# Altium schematic sheet Sensors.SchDoc
size A2; SheetNumber: 2; SheetTotal: 3
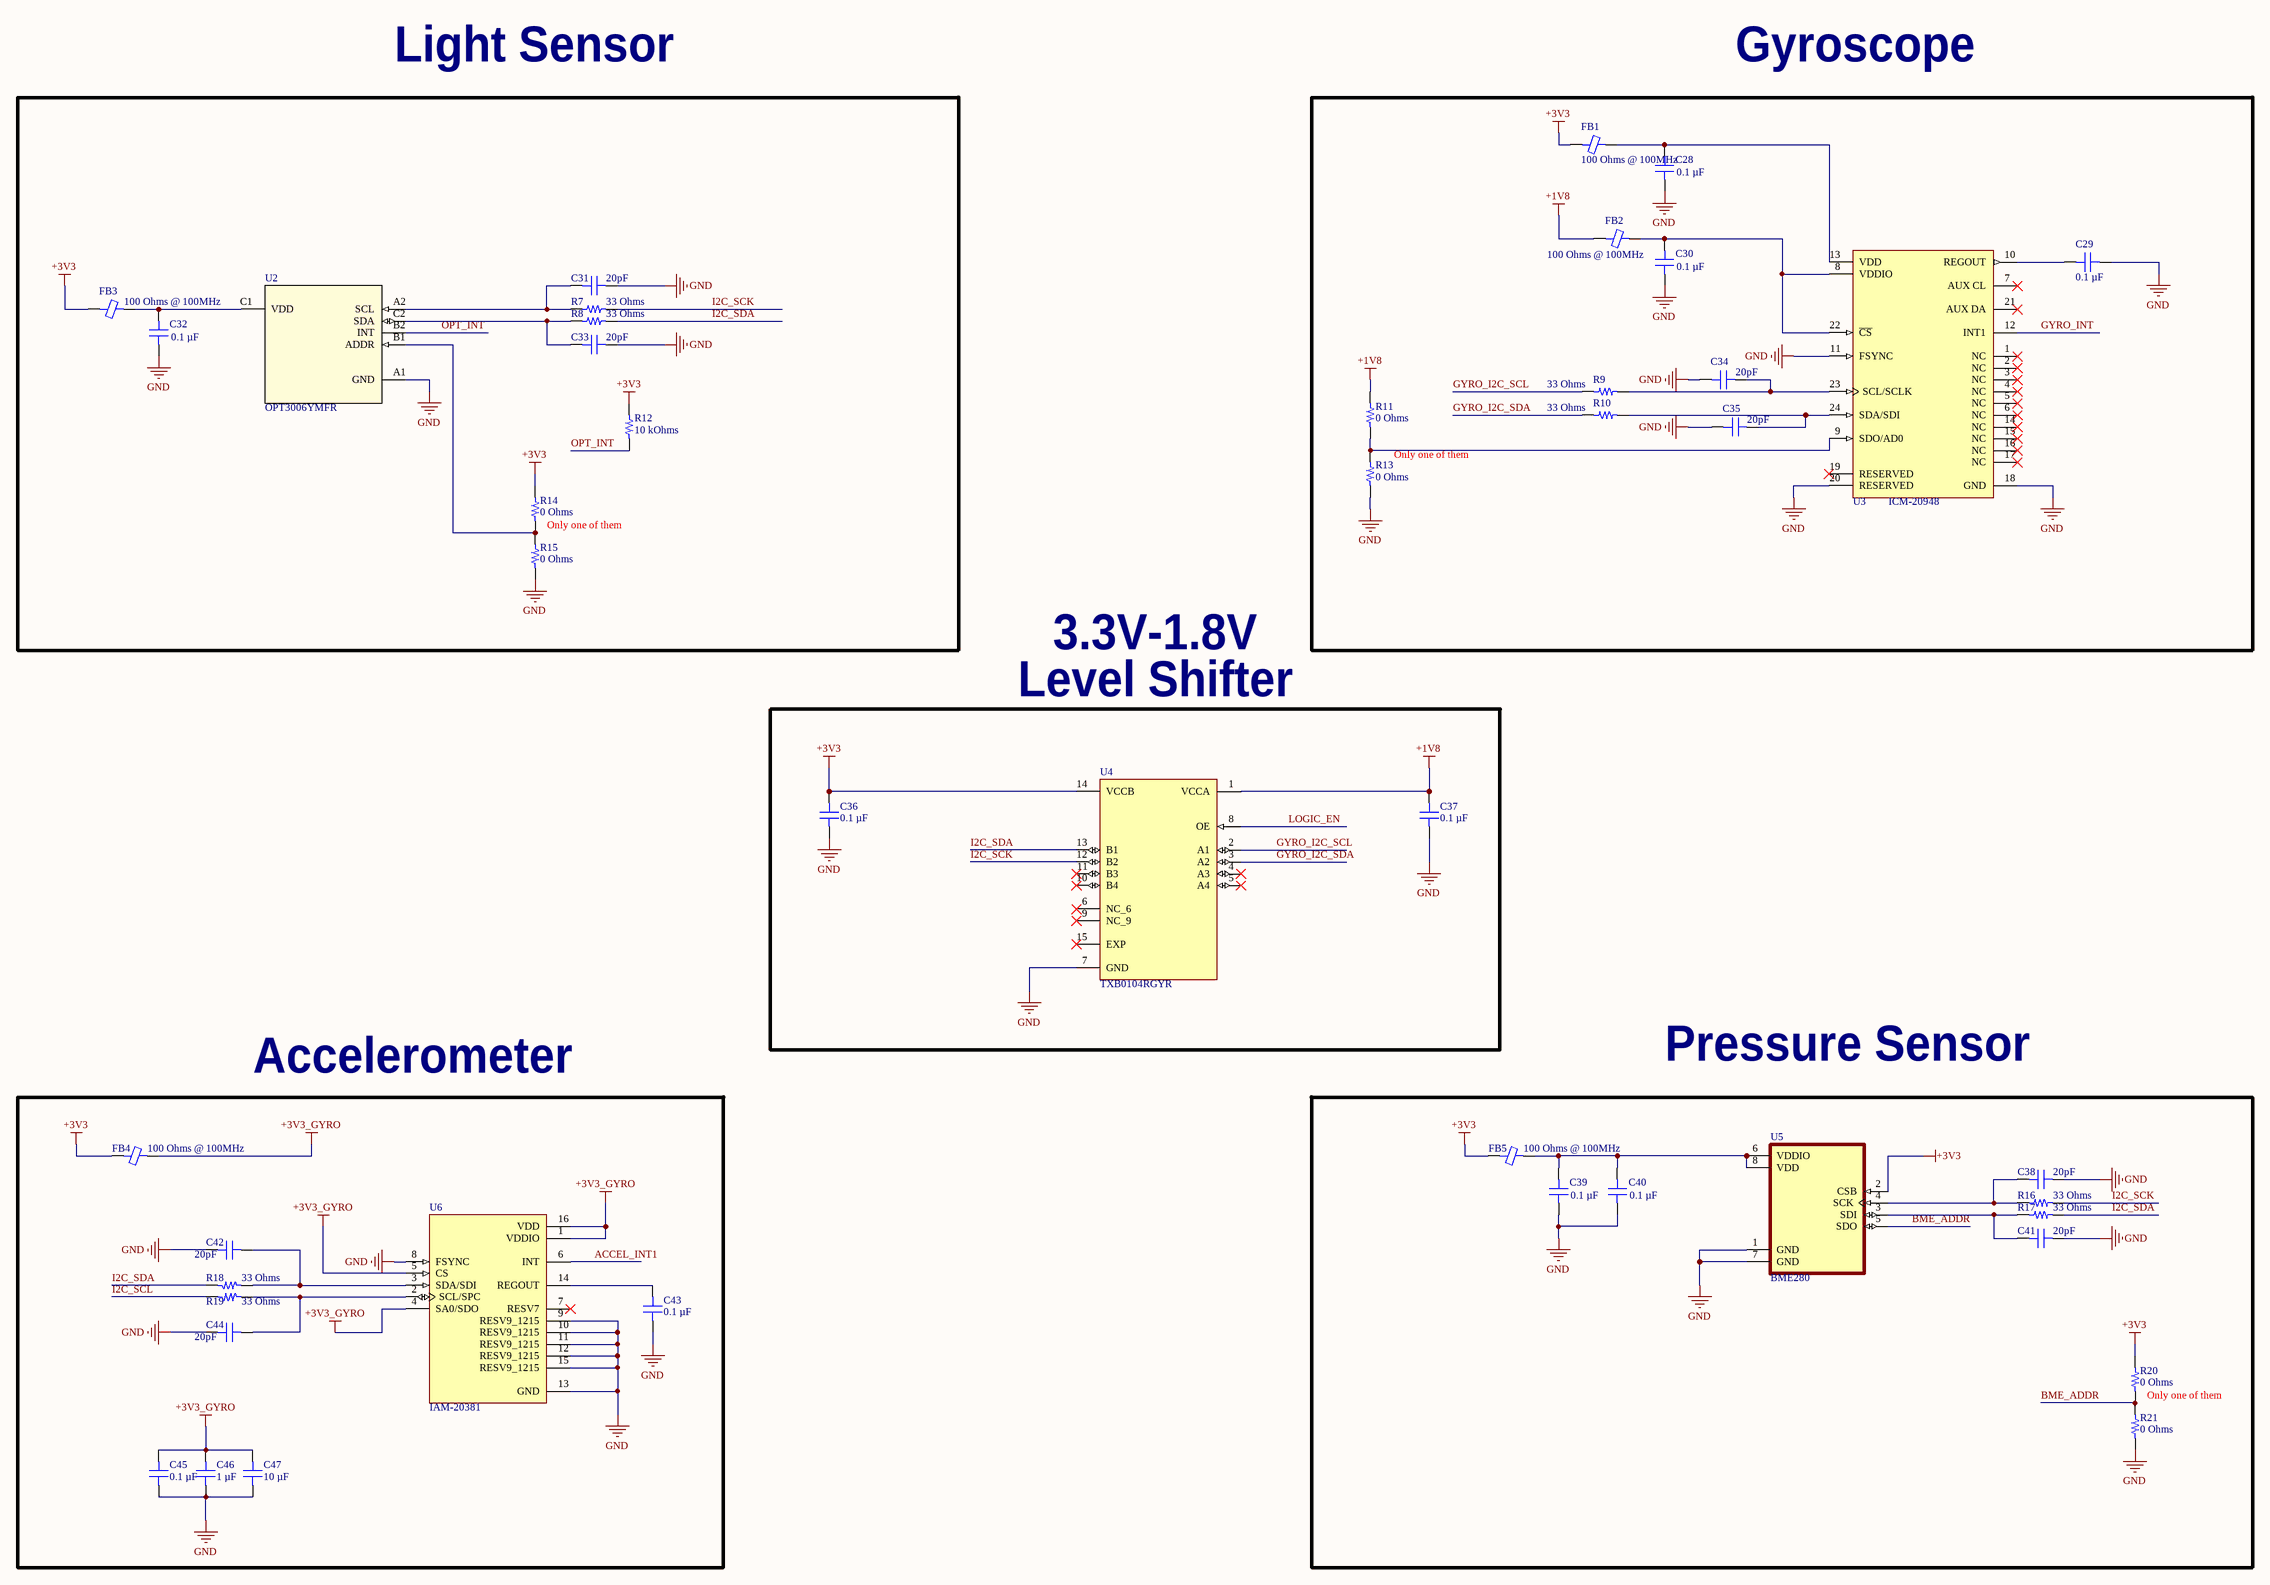
[diagram p0: Sensors.SchDoc]

## Parts
C28  0.1 µF  [CAP 0603_1608]
C29  0.1 µF  [CAP 0603_1608]
C30  0.1 µF  [CAP 0603_1608]
C31  20pF  [CAP 0603_1608]
C32  0.1 µF  [CAP 0603_1608]
C33  20pF  [CAP 0603_1608]
C34  20pF  [CAP 0603_1608]
C35  20pF  [CAP 0603_1608]
C36  0.1 µF  [CAP 0603_1608]
C37  0.1 µF  [CAP 0603_1608]
C38  20pF  [CAP 0603_1608]
C39  0.1 µF  [CAP 0603_1608]
C40  0.1 µF  [CAP 0603_1608]
C41  20pF  [CAP 0603_1608]
C42  20pF  [CAP 0603_1608]
C43  0.1 µF  [CAP 0603_1608]
C44  20pF  [CAP 0603_1608]
C45  0.1 µF  [CAP 0603_1608]
C46  1 µF  [CAP 0603_1608]
C47  10 µF  [CAP 0603_1608]
FB1  100 Ohms @ 100MHz  [FER 0402_1005]
FB2  100 Ohms @ 100MHz  [FER 0402_1005]
FB3  100 Ohms @ 100MHz  [FER 0402_1005]
FB4  100 Ohms @ 100MHz  [FER 0402_1005]
FB5  100 Ohms @ 100MHz  [FER 0402_1005]
R7  33 Ohms  [RES 0603_1608]
R8  33 Ohms  [RES 0603_1608]
R9  33 Ohms  [RES 0603_1608]
R10  33 Ohms  [RES 0603_1608]
R11  0 Ohms  [RES 0603_1608]
R12  10 kOhms  [RES 0603_1608]
R13  0 Ohms  [RES 0603_1608]
R14  0 Ohms  [RES 0603_1608]
R15  0 Ohms  [RES 0603_1608]
R16  33 Ohms  [RES 0603_1608]
R17  33 Ohms  [RES 0603_1608]
R18  33 Ohms  [RES 0603_1608]
R19  33 Ohms  [RES 0603_1608]
R20  0 Ohms  [RES 0603_1608]
R21  0 Ohms  [RES 0603_1608]
U2  OPT3006YMFR  [YMF0006A]
U3  ICM-20948  [TDK_InvenSense_0_IPC_C]
U4  TXB0104RGYR  [QFN50P350X350X100-15N]
U5  BME280  [PSON65P250X250X100-8N]
U6  IAM-20381  [PQFN50P300X300X80-16N]

## Blocks framed on the sheet
Only one of them: C31-C33 FB3 R7 R8 R12 R14 R15 U2
Only one of them: C28-C30 C34 C35 FB1 FB2 R9-R11 R13 U3
Level Shifter: C36 C37 U4
Accelerometer: C42-C47 FB4 R18 R19 U6
Only one of them: C38-C41 FB5 R16 R17 R20 R21 U5

## Nets
+1V8: C37.2 FB2.1 R11.2 U4.1(VCCA)
+3V3: C36.2 FB1.1 FB3.1 FB4.1 FB5.1 R12.1 R14.2 R20.2 U4.14(VCCB) U5.2(CSB)
+3V3_GYRO: C45.2 C46.2 C47.2 FB4.2 U6.1(VDDIO) U6.4(SA0/SDO) U6.5(CS) U6.16(VDD)
GND: C28.1 C29.1 C30.1 C31.2 C32.1 C33.2 C34.1 C35.1 C36.1 C37.1 C38.2 C39.1 C40.1 C41.2 C42.2 C43.1 C44.2 C45.1 C46.1 C47.1 R13.1 R15.1 R21.1 U2.A1(GND) U3.11(FSYNC) U3.18(GND) U3.20(RESERVED) U4.7(GND) U5.1(GND) U5.7(GND) U6.8(FSYNC) U6.9(RESV9_1215) U6.10(RESV9_1215) U6.11(RESV9_1215) U6.12(RESV9_1215) U6.13(GND) U6.15(RESV9_1215)
ACCEL_INT1: U6.6(INT)
BME_ADDR: R20.1 R21.2 U5.5(SDO)
GYRO_I2C_SCL: R9.1 U4.2(A1)
GYRO_I2C_SDA: R10.1 U4.3(A2)
GYRO_INT: U3.12(INT1)
I2C_SCK: R7.2 R16.2 U4.12(B2)
I2C_SCL: R19.2
I2C_SDA: R8.2 R17.2 R18.2 U4.13(B1)
LOGIC_EN: U4.8(OE)
OPT_INT: R12.2 U2.B2(INT)
NetC28_2: C28.2 FB1.2 U3.13(VDD)
NetC29_2: C29.2 U3.10(REGOUT)
NetC30_2: C30.2 FB2.2 U3.8(VDDIO) U3.22(~{CS})
NetC31_1: C31.1 R7.1 U2.A2(SCL)
NetC32_2: C32.2 FB3.2 U2.C1(VDD)
NetC33_1: C33.1 R8.1 U2.C2(SDA)
NetC34_2: C34.2 R9.2 U3.23(SCL/SCLK)
NetC35_2: C35.2 R10.2 U3.24(SDA/SDI)
NetC38_1: C38.1 R16.1 U5.4(SCK)
NetC39_2: C39.2 C40.2 FB5.2 U5.6(VDDIO) U5.8(VDD)
NetC41_1: C41.1 R17.1 U5.3(SDI)
NetC42_1: C42.1 R18.1 U6.3(SDA/SDI)
NetC43_2: C43.2 U6.14(REGOUT)
NetC44_1: C44.1 R19.1 U6.2(SCL/SPC)
NetR11_1: R11.1 R13.2 U3.9(SDO/AD0)
NetR14_1: R14.1 R15.2 U2.B1(ADDR)

Not connected (* = marked no-connect by the designer): U3 1(NC)* 2(NC)* 3(NC)* 4(NC)* 5(NC)* 6(NC)* 7(AUX_CL)* 14(NC)* 15(NC)* 16(NC)* 17(NC)* 19(RESERVED)* 21(AUX_DA)*; U4 4(A3)* 5(A4)* 6(NC_6)* 9(NC_9)* 10(B4)* 11(B3)* 15(EXP)*; U6 7(RESV7)*

## Notes on the sheet
- Light Sensor
- Gyroscope
- 3.3V-1.8V
- Pressure Sensor

## Library data of the parts
C28-C30 C32 C39 C40 = CS0603KRX7R7BB104: CAP CER 0.1UF 16V X7R 0603; manufacturer: Yageo; Tolerance: ±10%; Part Number: CS0603KRX7R7BB104; Value: 0.1 µF; Applications: Boardflex Sensitive; Capacitance: 0.1 µF; componentlink1description: Datasheet; componentlink1url: http://www.yageo.com/NewPortal/yageodocoutput?fileName=/pdf/MLCC/UPY-ST_NPOX7R_16V-to-3KV_5.pdf; componentlink2description: DigiKey Link; componentlink2url: https://www.digikey.com/en/products/detail/yageo/CS0603KRX7R7BB104/6097897; Device Package: 0603 (1608 Metric); Features: Soft Termination; lastupdated: 12.06.2022 00:52:33; Lifecycle Status: Active; Minimum Order: 1; Mounting Type: Surface Mount, MLCC; Operating Temperature: -55°C ~ 125°C; Package / Case: 0603 (1608 Metric); packaging: TapeAndReel; partid: 2286; Part Status: Active; price: 0.02; series: CS; Size / Dimension: 0.063" L x 0.031" W (1.60mm x 0.80mm); Supplier 1: DigiKey; Supplier Part Number 1: 311-3560-1-ND; Temperature Coefficient: X7R; Thickness (Max): 0.037" (0.95mm); Voltage - Rated: 16V
C31 C33-C35 C38 C41 C42 C44 = 06033A200JAT2A: CAP CER 20PF 25V C0G/NP0 0603; manufacturer: AVX Corporation; Temperature Coefficient: C0G, NP0; Tolerance: ±5%; Part Number: 06033A200JAT2A; Value: 20pF; Applications: General Purpose; Capacitance: 20pF; componentlink1description: Datasheet; componentlink1url: http://datasheets.avx.com/C0GNP0-Dielectric.pdf; componentlink2description: DigiKey Link; componentlink2url: http://digikey.com/product-detail/en/avx-corporation/06033A200JAT2A/478-11802-1-ND/8573438; Device Package: 0603 (1608 Metric); lastupdated: 2.09.2020 01:03:34; Lifecycle Status: Active; Minimum Order: 1; Mounting Type: Surface Mount, MLCC; Operating Temperature: -55°C ~ 125°C; Package / Case: 0603 (1608 Metric); packaging: TapeAndReel; partid: 3067; Part Status: Active; price: 0.04; series: -; Size / Dimension: 0.063" L x 0.032" W (1.60mm x 0.81mm); Supplier 1: DigiKey; Supplier Part Number 1: 478-11802-1-ND; Thickness (Max): 0.035" (0.90mm); Voltage - Rated: 25V
C36 C37 C43 C45 = TMK107BJ104KA-T: CAP CER 0.1UF 25V X5R 0603; manufacturer: Taiyo Yuden; Tolerance: ±10%; Part Number: TMK107BJ104KA-T; Value: 0.1 µF; Applications: SMPS Filtering; Capacitance: 0.1 µF; componentlink1description: Datasheet; componentlink1url: https://www.yuden.co.jp/productdata/catalog/mlcc01_e.pdf; componentlink2description: DigiKey Link; componentlink2url: https://www.digikey.com/en/products/detail/taiyo-yuden/TMK107BJ104KA-T/930597; Device Package: 0603 (1608 Metric); lastupdated: 18.06.2022 05:53:04; Lifecycle Status: Active; Minimum Order: 1; Mounting Type: Surface Mount, MLCC; Operating Temperature: -55°C ~ 85°C; Package / Case: 0603 (1608 Metric); packaging: TapeAndReel; partid: 9891; Part Status: Active; price: 0.01; series: M; Size / Dimension: 0.063" L x 0.031" W (1.60mm x 0.80mm); Supplier 1: DigiKey; Supplier Part Number 1: 587-1245-1-ND; Temperature Coefficient: X5R; Thickness (Max): 0.035" (0.90mm); Voltage - Rated: 25V
C46 = TMK107BJ105MAHT: CAP CER 1UF 25V X5R 0603; manufacturer: Taiyo Yuden; Tolerance: ±20%; Part Number: TMK107BJ105MAHT; Value: 1 µF; Applications: Automotive, SMPS Filtering; Capacitance: 1 µF; componentlink1description: Datasheet; componentlink1url: https://ds.yuden.co.jp/TYCOMPAS/ut/detail?pn=TMK107BJ105MAHT &u=M; componentlink2description: DigiKey Link; componentlink2url: https://www.digikey.com/en/products/detail/taiyo-yuden/TMK107BJ105MAHT/6563148; Device Package: 0603 (1608 Metric); Features: Ultra Low ESR; lastupdated: 18.06.2022 05:53:24; Lifecycle Status: Active; Minimum Order: 1; Mounting Type: Surface Mount, MLCC; Operating Temperature: -55°C ~ 85°C; Package / Case: 0603 (1608 Metric); packaging: TapeAndReel; partid: 2797; Part Status: Active; price: 0.02; Ratings: AEC-Q200; series: M; Size / Dimension: 0.063" L x 0.031" W (1.60mm x 0.80mm); Supplier 1: DigiKey; Supplier Part Number 1: 587-6356-1-ND; Temperature Coefficient: X5R; Thickness (Max): 0.035" (0.90mm); Voltage - Rated: 25V
C47 = TMK107BBJ106MA-T: CAP CER 10UF 25V X5R 0603; manufacturer: Taiyo Yuden; Tolerance: ±20%; Part Number: TMK107BBJ106MA-T; Value: 10 µF; Applications: SMPS Filtering; Capacitance: 10 µF; componentlink1description: Datasheet; componentlink1url: https://ds.yuden.co.jp/TYCOMPAS/ut/detail?pn=TMK107BBJ106MA-T &u=M; componentlink2description: DigiKey Link; componentlink2url: https://www.digikey.com/en/products/detail/taiyo-yuden/TMK107BBJ106MA-T/7403921; Device Package: 0603 (1608 Metric); lastupdated: 18.06.2022 05:53:06; Lifecycle Status: Active; Minimum Order: 1; Mounting Type: Surface Mount, MLCC; Operating Temperature: -55°C ~ 85°C; Package / Case: 0603 (1608 Metric); packaging: TapeAndReel; partid: 8967; Part Status: Active; price: 0.11; series: M; Size / Dimension: 0.063" L x 0.031" W (1.60mm x 0.80mm); Supplier 1: DigiKey; Supplier Part Number 1: 587-6023-1-ND; Temperature Coefficient: X5R; Thickness (Max): 0.039" (1.00mm); Voltage - Rated: 25V
FB1-FB5 = BBSY00100505101Y00: EMI BEAD FILETER; Manufacturer: Chilisin Electronics; Current Rating (Max): 500mA; DC Resistance (DCR) (Max): 250mOhm; Number of Lines: 1; Part Number: BBSY00100505101Y00; ComponentLink1Description: Datasheet; ComponentLink1URL: https://www.chilisin.com/upload/media/product/emi_bead/file/BBSY,BBBK_Series.pdf; ComponentLink2Description: DigiKey Link; ComponentLink2URL: http://digikey.com/product-detail/en/chilisin-electronics/BBSY00100505101Y00/2184-BBSY00100505101Y00CT-ND/10509212; Device Package: 0402 (1005 Metric); Impedance @ Frequency: 100 Ohms @ 100MHz; LastUpdated: 18.06.2022 06:33:57; Lifecycle Status: Active; Minimum Order: 1; Mounting Type: Surface Mount; Operating Temperature: -55°C ~ 125°C; Package / Case: 0402 (1005 Metric); Packaging: Unknown; PartId: 1772; Part Status: Active; Price: 0.01; Series: *; Supplier 1: DigiKey; Supplier Part Number 1: 2184-BBSY00100505101Y00CT-ND; Value: 100 Ohms @ 100MHz
R7-R10 R16-R19 = AC0603FR-0733RL: RES SMD 33 OHM 1% 1/10W 0603; Manufacturer: Yageo; Power (Watts): 0.1W, 1/10W; Temperature Coefficient: ±100ppm/°C; Part Number: AC0603FR-0733RL; Value: 33 Ohms; ComponentLink1Description: Datasheet; ComponentLink1URL: https://www.yageo.com/upload/media/product/productsearch/datasheet/rchip/PYu-AC_51_RoHS_L_7.pdf; ComponentLink2Description: DigiKey Link; ComponentLink2URL: https://www.digikey.com/en/products/detail/yageo/AC0603FR-0733RL/5896043; Composition: Thick Film; Device Package: 0603 (1608 Metric); Features: Automotive AEC-Q200, Moisture Resistant; Height - Seated (Max): 0.022" (0.55mm); LastUpdated: 18.06.2022 06:13:30; Lifecycle Status: Active; Minimum Order: 1; Number of Terminations: 2; Operating Temperature: -55°C ~ 155°C; Package / Case: 0603 (1608 Metric); Packaging: CutTape; PartId: 17381; Part Status: Active; Price: 0.01; Ratings: AEC-Q200; Resistance: 33 Ohms; Series: AC; Size / Dimension: 0.063" L x 0.031" W (1.60mm x 0.80mm); Supplier 1: DigiKey; Supplier Part Number 1: YAG3599CT-ND; Supplier Device Package: 0603; Tolerance: ±1%
R11 R13-R15 R20 R21 = 5110: RES SMD 0 OHM JUMPER 1/2W 0603; Part Number: 5110; Manufacturer: Keystone Electronics; Power (Watts): 0.5W, 1/2W; Value: 0 Ohms; ComponentLink1Description: Datasheet; ComponentLink1URL: http://keyelco.com/userAssets/file/M65p54.pdf; ComponentLink2Description: DigiKey Link; ComponentLink2URL: https://www.digikey.com/en/products/detail/keystone-electronics/5110/5118870; Composition: Metal Element; Device Package: 0603 (1608 Metric); Height - Seated (Max): 0.028" (0.70mm); LastUpdated: 18.06.2022 06:13:19; Lifecycle Status: Active; Minimum Order: 1; Number of Terminations: 2; Package / Case: 0603 (1608 Metric); Packaging: TapeAndReel; PartId: 20779; Part Status: Active; Price: 0.16; Resistance: 0 Ohms; Series: -; Size / Dimension: 0.061" L x 0.033" W (1.55mm x 0.85mm); Supplier 1: DigiKey; Supplier Part Number 1: 36-5110CT-ND; Supplier Device Package: 0603; Tolerance: Jumper
R12 = AC0603JR-0710KL: RES SMD 10K OHM 5% 1/10W 0603; Manufacturer: Yageo; Power (Watts): 0.1W, 1/10W; Temperature Coefficient: ±100ppm/°C; Part Number: AC0603JR-0710KL; Value: 10 kOhms; ComponentLink1Description: Datasheet; ComponentLink1URL: https://www.yageo.com/upload/media/product/productsearch/datasheet/rchip/PYu-AC_51_RoHS_L_7.pdf; ComponentLink2Description: DigiKey Link; ComponentLink2URL: https://www.digikey.com/en/products/detail/yageo/AC0603JR-0710KL/2827830; Composition: Thick Film; Device Package: 0603 (1608 Metric); Features: Automotive AEC-Q200, Moisture Resistant; Height - Seated (Max): 0.022" (0.55mm); LastUpdated: 18.06.2022 06:13:45; Lifecycle Status: Active; Minimum Order: 1; Number of Terminations: 2; Operating Temperature: -55°C ~ 155°C; Package / Case: 0603 (1608 Metric); Packaging: CutTape; PartId: 12247; Part Status: Active; Price: 0.01; Ratings: AEC-Q200; Resistance: 10 kOhms; Series: AC; Size / Dimension: 0.063" L x 0.031" W (1.60mm x 0.80mm); Supplier 1: DigiKey; Supplier Part Number 1: 311-10KLECT-ND; Supplier Device Package: 0603; Tolerance: ±5%
U2 = OPT3006YMFR: No Description Available; Mfr_Name: Texas Instruments; Type: DEV; RefDes: RefDes; Copyright: Copyright (C) 2022 Ultra Librarian. All rights reserved.; Manufacturer_Part_Number: OPT3006YMFR; Digi-Key_Part_Number_1: 296-45132-1-ND; Digi-Key_Part_Number_2: 296-45132-2-ND; Digi-Key_Part_Number_3: 296-45132-6-ND
U3 = ICM-20948: Accelerometer, Gyroscope, Magnetometer, 9 Axis Sensor I²C, SPI Output; Manufacturer: TDK InvenSense; Accel Range: 2/4/8/16g; Accel Resolution: 16bits; Accel Sensitivity: 2048/4096/8192/16384LSB/g; Gyro Range: 250/500/1000/2000°/s; Gyro Sensitivity: 16.4/32.8/65.5/131LSB/°/s; Mag Sense Range: 4900uT; Mag Sensitivity: 0.15uT/LSB; Max Supply Voltage: 3.6V; Min Supply Voltage: 1.71V; Operating Supply Current: 8-3110uA; Sensor Output: I2C,SPI; Standoff Height: 0mm; Symbol Hash: f55aed9b0ea5cc58222276bed1303401ef86fe4f7dd241f5d042c171e1ba1323; Verification Version: 0.0.0.3; Datasheet Path: datasheets/IC_TDK_InvenSense_ICM-20948_eec.pdf; Ambient Temperature Range High: +85°C; Ambient Temperature Range Low: -40°C; Automotive: No; ComponentLink1Description: Upverter; ComponentLink1URL: https://upverter.com/part/id/133434ff2df35346/; ComponentLink2Description: Datasheet; ComponentLink2URL: https://invensense.tdk.com/wp-content/uploads/2016/06/DS-000189-ICM-20948-v1.3.pdf?ref_disty=digikey; Digikey Description: IMU ACCEL/GYRO/COMPI2C/SPI 24QFN; Digikey Part Number: 1428-1123-1-ND; Height: 1.05mm; Ipc Land Pattern Name: QFN40P300X300X100-24; Lead Free: Yes; Mouser Part Number: 410-ICM-20948; Package: 0; Part Number: ICM-20948; Resolution: 16bits; RoHS: TRUE; Sensor Type: Accelerometer,Gyroscope,Magnetometer; Supplier 1: Digi-Key; Supplier 2: Mouser; Supplier Part Number 1: 1428-1123-1-ND; Supplier Part Number 2: 410-ICM-20948; Temperature: -40°C to +85°C; Temperature Range High: +85°C; Temperature Range Low: -40°C; helpURL: https://upverter.com/part/id/133434ff2df35346/
U4 = TXB0104RGYR: 4-Bit Bidirectional Voltage-Level Shifter with Auto Direction Sensing and +/-15 kV ESD Protect 14-VQFN -40 to 85; Package: None; Price: None; Value: *; MP: TXB0104RGYR; Availability: Unavailable
U5 = BME280: DIGITAL HUMIDITY, PRESSURE AND TEMPERATURE SENSOR<br>* Digital interface IÂ²C (up to 3.4 MHz) and SPI (3 and 4 wire, up to 10 MHz)* Supply voltage VDD main supply voltage range: 1.71 V to 3.6 V*VDDIO interface voltage range: 1.2 V to 3.6 V<br> Operating range -40â€¦+85 Â°C, 0â€¦100 % rel. humidity, 300â€¦1100 hPa <br><br>  The library has been designed by<a href="https://www.facebook.com/groups/eaglecadsoftUK"> Richard Magdycz</a>; Price: None; MP: BME280; Value: *; Availability: Unavailable; Package: None
U6 = IAM-20381: Accelerometer X, Y, Z Axis Â±2g, 4g, 8g, 16g 16-LGA (3x3); MF: TDK InvenSense; Package: PQFN-16 TDK-InvenSense; Availability: Bad; SnapEDA_Link: https://www.snapeda.com/parts/IAM-20381/TDK%20InvenSense/view-part/2757131/?ref=snap; MP: IAM-20381; Price: None; Value: *; Check_prices: https://www.snapeda.com/parts/IAM-20381/TDK%20InvenSense/view-part/2757131/?ref=eda